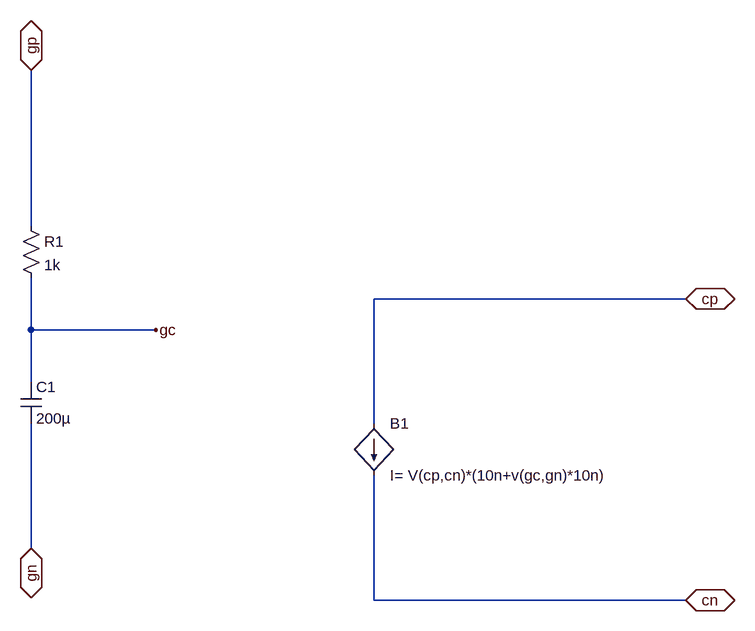
[diagram p0: schematic capteur.asc]
capteur.asc, the LTspice schematic file:
Version 4
SHEET 1 880 680
WIRE -384 -192 -384 -432
WIRE 624 -80 144 -80
WIRE -384 -32 -384 -112
WIRE -192 -32 -384 -32
WIRE -384 48 -384 -32
WIRE 144 112 144 -80
WIRE -384 304 -384 112
WIRE 144 384 144 192
WIRE 624 384 144 384
FLAG 624 -80 cp
IOPIN 624 -80 BiDir
FLAG 624 384 cn
IOPIN 624 384 BiDir
FLAG -384 304 gn
IOPIN -384 304 BiDir
FLAG -384 -432 gp
IOPIN -384 -432 BiDir
FLAG -192 -32 gc
SYMBOL bi 144 112 R0
SYMATTR InstName B1
SYMATTR Value I= V(cp,cn)*(10n+v(gc,gn)*10n)
SYMBOL res -400 -208 R0
SYMATTR InstName R1
SYMATTR Value 1k
SYMBOL cap -400 48 R0
SYMATTR InstName C1
SYMATTR Value 200µ

The netlist it stands for:
* capteur.asc
B1 cp cn I= V(cp,cn)*(10n+v(gc,gn)*10n)
R1 gp gc 1k
C1 gc gn 200µ
.backanno
.end